# Altium schematic sheet Sheet4.SchDoc
size B
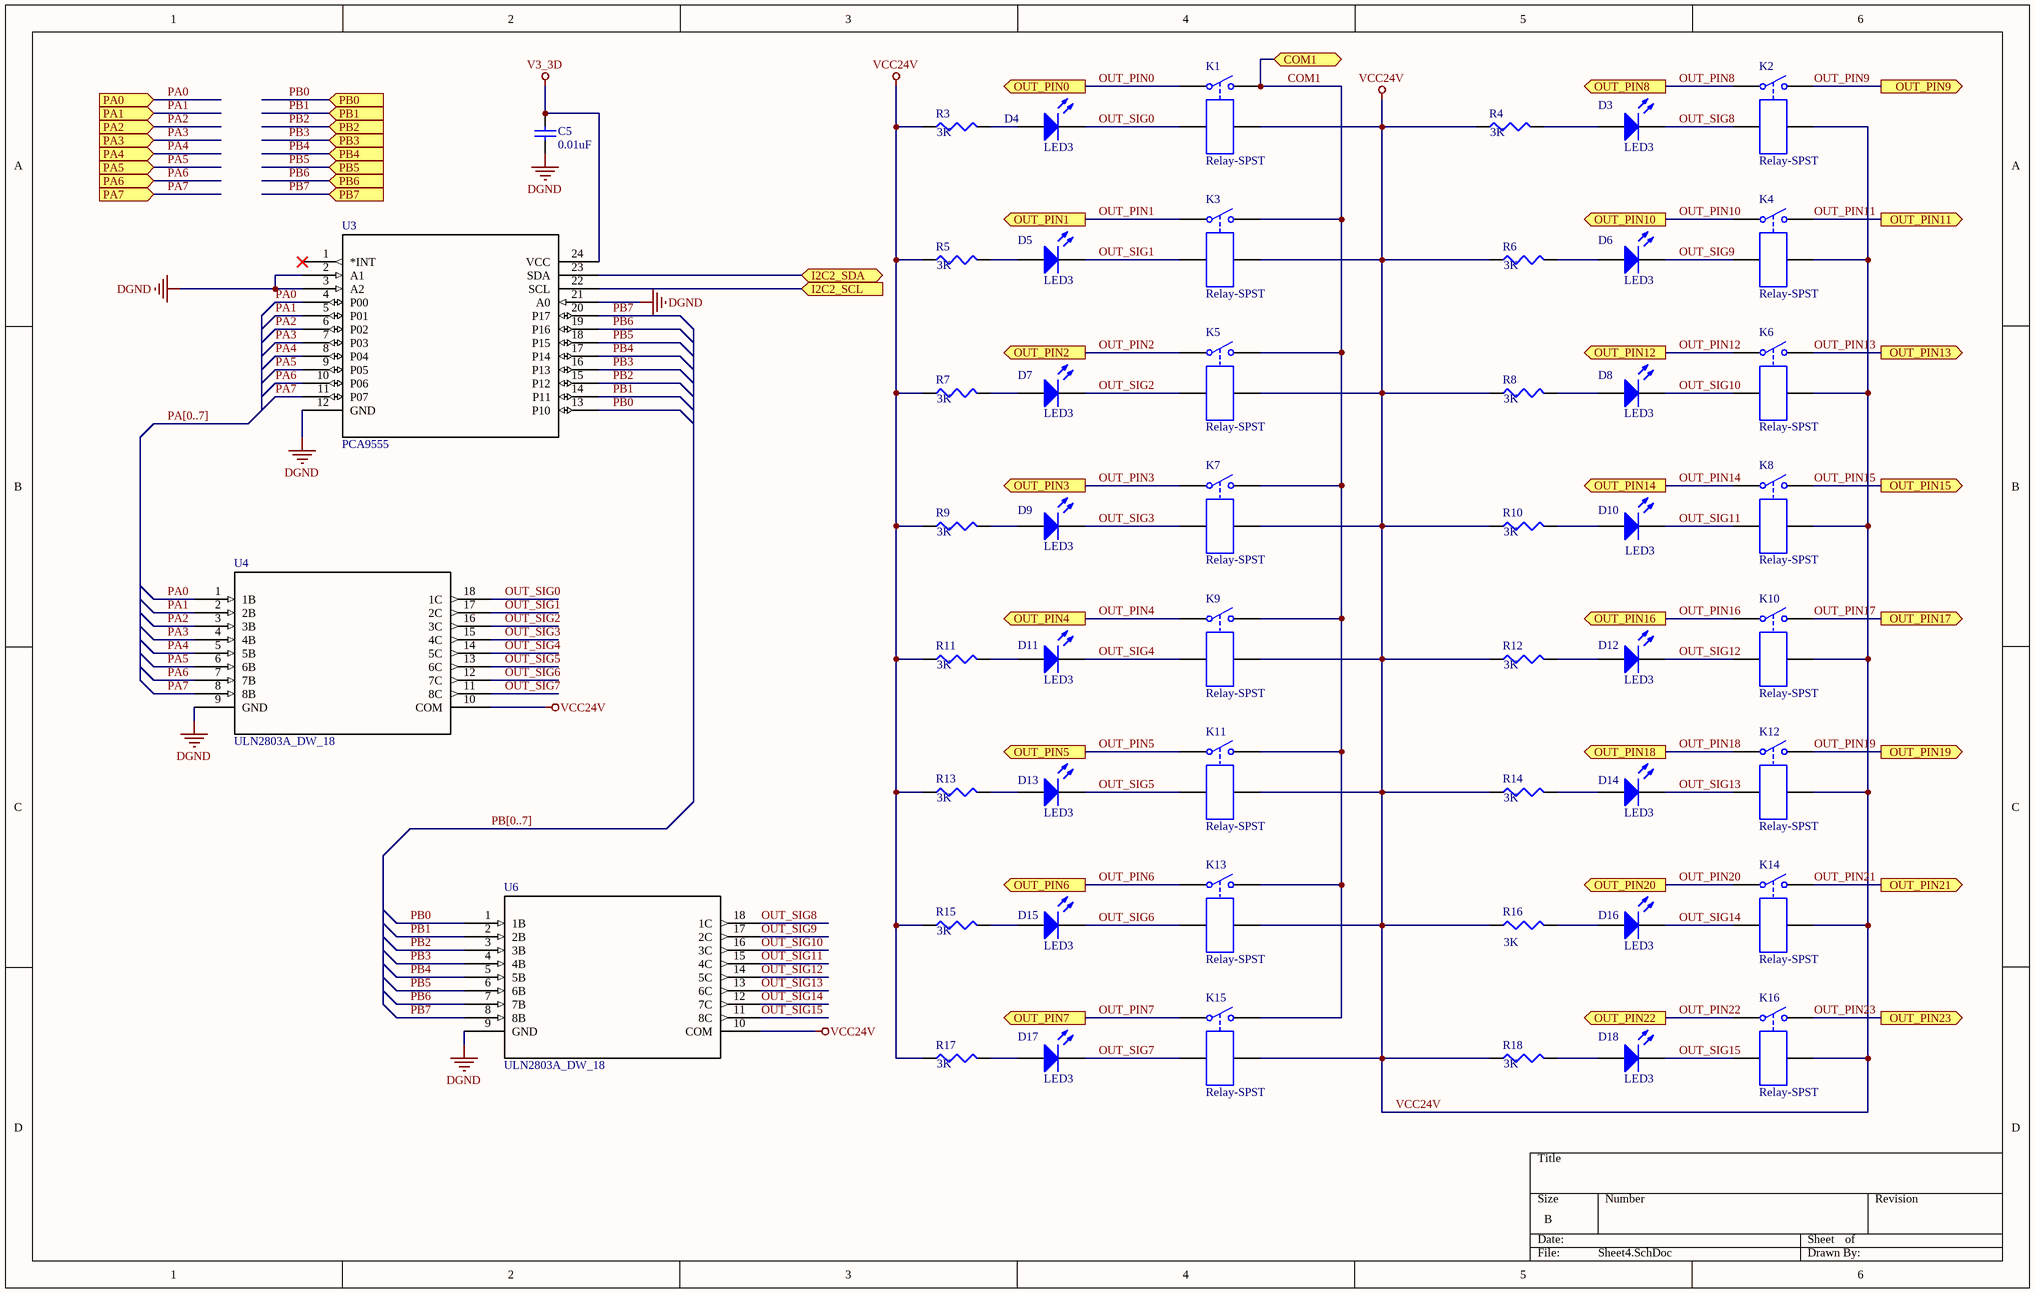
[diagram p0: Sheet4.SchDoc]

## Parts
C5  0.01uF  [0805_cap]
D3  LED3  [0805LED]
D4  LED3  [0805LED]
D5  LED3  [0805LED]
D6  LED3  [0805LED]
D7  LED3  [0805LED]
D8  LED3  [0805LED]
D9  LED3  [0805LED]
D10  LED3  [0805LED]
D11  LED3  [0805LED]
D12  LED3  [0805LED]
D13  LED3  [0805LED]
D14  LED3  [0805LED]
D15  LED3  [0805LED]
D16  LED3  [0805LED]
D17  LED3  [0805LED]
D18  LED3  [0805LED]
K1  Relay-SPST  [PA1a-24v]
K2  Relay-SPST  [PA1a-24v]
K3  Relay-SPST  [PA1a-24v]
K4  Relay-SPST  [PA1a-24v]
K5  Relay-SPST  [PA1a-24v]
K6  Relay-SPST  [PA1a-24v]
K7  Relay-SPST  [PA1a-24v]
K8  Relay-SPST  [PA1a-24v]
K9  Relay-SPST  [PA1a-24v]
K10  Relay-SPST  [PA1a-24v]
K11  Relay-SPST  [PA1a-24v]
K12  Relay-SPST  [PA1a-24v]
K13  Relay-SPST  [PA1a-24v]
K14  Relay-SPST  [PA1a-24v]
K15  Relay-SPST  [PA1a-24v]
K16  Relay-SPST  [PA1a-24v]
R3  3K  [0805]
R4  3K  [0805]
R5  3K  [0805]
R6  3K  [0805]
R7  3K  [0805]
R8  3K  [0805]
R9  3K  [0805]
R10  3K  [0805]
R11  3K  [0805]
R12  3K  [0805]
R13  3K  [0805]
R14  3K  [0805]
R15  3K  [0805]
R16  3K  [0805]
R17  3K  [0805]
R18  3K  [0805]
U3  PCA9555  [PW24]
U4  ULN2803A_DW_18  [DW18]
U6  ULN2803A_DW_18  [DW18]

## Ports
COM1 (bidir), I2C2_SCL (in), I2C2_SDA (bidir), OUT_PIN0 (out), OUT_PIN1 (out), OUT_PIN2 (out), OUT_PIN3 (out), OUT_PIN4 (out), OUT_PIN5 (out), OUT_PIN6 (out), OUT_PIN7 (out), OUT_PIN8 (out), OUT_PIN9 (out), OUT_PIN10 (out), OUT_PIN11 (out), OUT_PIN12 (out), OUT_PIN13 (out), OUT_PIN14 (out), OUT_PIN15 (out), OUT_PIN16 (out), OUT_PIN17 (out), OUT_PIN18 (out), OUT_PIN19 (out), OUT_PIN20 (out), OUT_PIN21 (out), OUT_PIN22 (out), OUT_PIN23 (out), PA0 (in), PA1 (in), PA2 (in), PA3 (in), PA4 (in), PA5 (in), PA6 (in), PA7 (in), PB0 (in), PB1 (in), PB2 (in), PB3 (in), PB4 (in), PB5 (in), PB6 (in), PB7 (in)

## Nets
DGND: C5.1 U3.2(A1) U3.3(A2) U3.12(GND) U3.21(A0) U4.9(GND) U6.9(GND)
V3_3D: C5.2 U3.24(VCC)
VCC24V: K1.4 K2.4 K3.4 K4.4 K5.4 K6.4 K7.4 K8.4 K9.4 K10.4 K11.4 K12.4 K13.4 K14.4 K15.4 K16.4 R3.1 R4.1 R5.1 R6.1 R7.1 R8.1 R9.1 R10.1 R11.1 R12.1 R13.1 R14.1 R15.1 R16.1 R17.1 R18.1 U4.10(COM) U6.10(COM)
COM1: K1.2 K3.2 K5.2 K7.2 K9.2 K11.2 K13.2 K15.2 ; port COM1
I2C2_SCL: U3.22(SCL) ; port I2C2_SCL
I2C2_SDA: U3.23(SDA) ; port I2C2_SDA
OUT_PIN0: K1.1 ; port OUT_PIN0
OUT_PIN1: K3.1 ; port OUT_PIN1
OUT_PIN2: K5.1 ; port OUT_PIN2
OUT_PIN3: K7.1 ; port OUT_PIN3
OUT_PIN4: K9.1 ; port OUT_PIN4
OUT_PIN5: K11.1 ; port OUT_PIN5
OUT_PIN6: K13.1 ; port OUT_PIN6
OUT_PIN7: K15.1 ; port OUT_PIN7
OUT_PIN8: K2.1 ; port OUT_PIN8
OUT_PIN9: K2.2 ; port OUT_PIN9
OUT_PIN10: K4.1 ; port OUT_PIN10
OUT_PIN11: K4.2 ; port OUT_PIN11
OUT_PIN12: K6.1 ; port OUT_PIN12
OUT_PIN13: K6.2 ; port OUT_PIN13
OUT_PIN14: K8.1 ; port OUT_PIN14
OUT_PIN15: K8.2 ; port OUT_PIN15
OUT_PIN16: K10.1 ; port OUT_PIN16
OUT_PIN17: K10.2 ; port OUT_PIN17
OUT_PIN18: K12.1 ; port OUT_PIN18
OUT_PIN19: K12.2 ; port OUT_PIN19
OUT_PIN20: K14.1 ; port OUT_PIN20
OUT_PIN21: K14.2 ; port OUT_PIN21
OUT_PIN22: K16.1 ; port OUT_PIN22
OUT_PIN23: K16.2 ; port OUT_PIN23
OUT_SIG0: D4.2(K) K1.3 U4.18(1C)
OUT_SIG1: D5.2(K) K3.3 U4.17(2C)
OUT_SIG2: D7.2(K) K5.3 U4.16(3C)
OUT_SIG3: D9.2(K) K7.3 U4.15(4C)
OUT_SIG4: D11.2(K) K9.3 U4.14(5C)
OUT_SIG5: D13.2(K) K11.3 U4.13(6C)
OUT_SIG6: D15.2(K) K13.3 U4.12(7C)
OUT_SIG7: D17.2(K) K15.3 U4.11(8C)
OUT_SIG8: D3.2(K) K2.3 U6.18(1C)
OUT_SIG9: D6.2(K) K4.3 U6.17(2C)
OUT_SIG10: D8.2(K) K6.3 U6.16(3C)
OUT_SIG11: D10.2(K) K8.3 U6.15(4C)
OUT_SIG12: D12.2(K) K10.3 U6.14(5C)
OUT_SIG13: D14.2(K) K12.3 U6.13(6C)
OUT_SIG14: D16.2(K) K14.3 U6.12(7C)
OUT_SIG15: D18.2(K) K16.3 U6.11(8C)
PA0: U3.4(P00) U4.1(1B) ; port PA0
PA1: U3.5(P01) U4.2(2B) ; port PA1
PA2: U3.6(P02) U4.3(3B) ; port PA2
PA3: U3.7(P03) U4.4(4B) ; port PA3
PA4: U3.8(P04) U4.5(5B) ; port PA4
PA5: U3.9(P05) U4.6(6B) ; port PA5
PA6: U3.10(P06) U4.7(7B) ; port PA6
PA7: U3.11(P07) U4.8(8B) ; port PA7
PB0: U3.13(P10) U6.1(1B) ; port PB0
PB1: U3.14(P11) U6.2(2B) ; port PB1
PB2: U3.15(P12) U6.3(3B) ; port PB2
PB3: U3.16(P13) U6.4(4B) ; port PB3
PB4: U3.17(P14) U6.5(5B) ; port PB4
PB5: U3.18(P15) U6.6(6B) ; port PB5
PB6: U3.19(P16) U6.7(7B) ; port PB6
PB7: U3.20(P17) U6.8(8B) ; port PB7
NetD3_1: D3.1(A) R4.2
NetD4_1: D4.1(A) R3.2
NetD5_1: D5.1(A) R5.2
NetD6_1: D6.1(A) R6.2
NetD7_1: D7.1(A) R7.2
NetD8_1: D8.1(A) R8.2
NetD9_1: D9.1(A) R9.2
NetD10_1: D10.1(A) R10.2
NetD11_1: D11.1(A) R11.2
NetD12_1: D12.1(A) R12.2
NetD13_1: D13.1(A) R13.2
NetD14_1: D14.1(A) R14.2
NetD15_1: D15.1(A) R15.2
NetD16_1: D16.1(A) R16.2
NetD17_1: D17.1(A) R17.2
NetD18_1: D18.1(A) R18.2

Not connected (* = marked no-connect by the designer): U3 1(*INT)*

## Buses and harness runs
bus PA[0..7]
bus PB[0..7]

## Library data of the parts
C5 = Cap: Capacitor; Published: 8-Jun-2000; LatestRevisionDate: 17-Jul-2002; LatestRevisionNote: Re-released for DXP Platform.; PackageReference: RAD-0.3; Publisher: Altium Limited; PackageDescription: Radial Cap, Thru-Hole; 2 Leads; 0.3 in Pin Spacing; Value: 0.01uF
D3-D18 = LED3: Typical BLUE SiC LED; Published: 8-Jun-2000; LatestRevisionDate: 17-Dec-2003; LatestRevisionNote: PCB Footprint replaced.; DatasheetVersion: 16-Apr-2002; PackageVersion: 16-Apr-2002; PackageReference: 3.5X2.8X1.9; Publisher: Altium Limited; PackageDescription: SM LED; 2 C-Bend Leads; Body 3.5 x 2.8 x 1.9 mm, inc leads (LxWxH typ)
K1-K16 = Relay-SPST: Single-Pole Single-Throw Relay; Published: 24-Mar-1999; LatestRevisionDate: 17-Jul-2002; LatestRevisionNote: Re-released for DXP Platform.; PackageReference: MODULE4; Publisher: Altium Limited
R3-R18 = Res3: Resistor; Published: 8-Jun-2000; LatestRevisionDate: 29-May-2009; LatestRevisionNote: IPC-7351 Footprint Added.; PackageReference: J1-0603; Publisher: Altium Limited; PackageDescription: Chip Resistor; Value: 3K
U3 = PCF8575_PW_24: Imported; Manufacturer: Texas Instruments; INDUSTRY_STD_PKG_TYPE: TSSOP; FAMILY_NAME: I2C IO EXPANDER; PIN_COUNT: 24; PACKAGE_DESIGNATOR: PW; Datasheet URL: http://www.ti.com/lit/gpn/PCF8575; GENERIC_PART_NUMBER: PCF8575; Vendor: Texas Instruments; Manufacturer_Part_Number: pcf8575_pw_24; RefDes: RefDes; Type: DEV; Value: Value
U4 U6 = ULN2803A_DW_18: Imported; Manufacturer: Texas Instruments; INDUSTRY_STD_PKG_TYPE: SOIC; FAMILY_NAME: PERIPHERAL DRIVER AND ACTUATOR; PIN_COUNT: 18; PACKAGE_DESIGNATOR: DW; Datasheet URL: http://www.ti.com/lit/gpn/ULN2803A; GENERIC_PART_NUMBER: ULN2803A; RefDes: RefDes; Type: DEV; Value: Value